# Altium schematic sheet S10_Reset_Logic.SchDoc: Reset Logic
size 381 x 241 mm; SheetNumber: 10; SheetTotal: 12
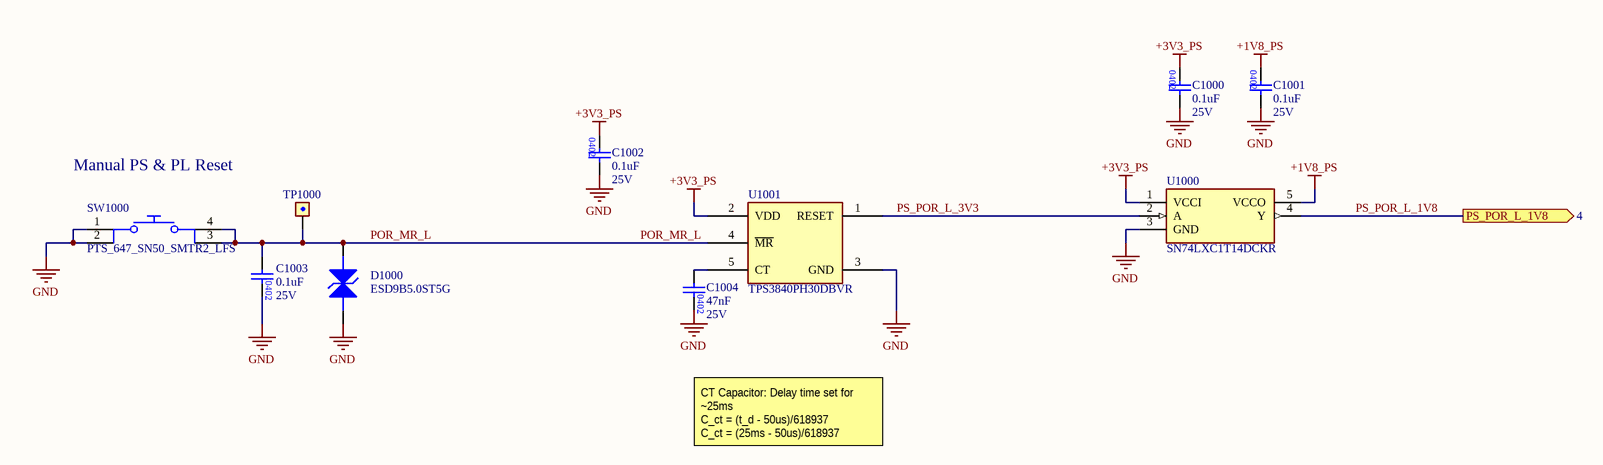
[diagram p0: S10_Reset_Logic.SchDoc]

## Parts
C1000  value 0.1uF  Voltage Rating: 25V  [CAP0402]  (hidden comment: CAP_0402)
C1001  value 0.1uF  Voltage Rating: 25V  [CAP0402]  (hidden comment: CAP_0402)
C1002  value 0.1uF  Voltage Rating: 25V  [CAP0402]  (hidden comment: CAP_0402)
C1003  value 0.1uF  Voltage Rating: 25V  [CAP0402]  (hidden comment: CAP_0402)
C1004  value 47nF  Voltage Rating: 25V  [CAP0402]  (hidden comment: CAP_0402)
D1000  ESD9B5.0ST5G  [ONSEMI_SOD-923]
SW1000  PTS_647_SN50_SMTR2_LFS  [TACTILE_SW_4.5MM]
TP1000  1mm Round Pad Testpoint  [TP_1MM]  (value not drawn)
U1000  SN74LXC1T14DCKR  [TI_SC70_DCK0005A]
U1001  TPS3840PH30DBVR  [TI_SOT23_DBV0005A]

## Ports
PS_POR_L_1V8 (out, see 4)

## Nets
+1V8_PS: C1001.1 U1000.5(VCCO)
+3V3_PS: C1000.1 C1002.1 U1000.1(VCCI) U1001.2(VDD)
GND: C1000.2 C1001.2 C1002.2 C1003.2 C1004.2 D1000.K(Cathode) SW1000.1 SW1000.2 U1000.3(GND) U1001.3(GND)
POR_MR_L: C1003.1 D1000.A(Anode) SW1000.3 SW1000.4 TP1000.1 U1001.4(~{MR})
PS_POR_L_1V8: U1000.4(Y) ; port PS_POR_L_1V8
PS_POR_L_3V3: U1000.2(A) U1001.1(RESET)
NetC1004_1: C1004.1 U1001.5(CT)

## Notes on the sheet
- Manual PS & PL Reset
- CT Capacitor: Delay time set for ~25ms
  C_ct = (t_d - 50us)/618937
  C_ct = (25ms - 50us)/618937
  C_ct = 40.3nF
- Engineer
- Date
- Revision
- Sheet Number

## Library data of the parts
C1000-C1003 = CAP_CL05A104KA5NNNC: CAP CER 0.1UF 25V X5R 0402; Manufacturer: Samsung Electro-Mechanics; Tolerance: 10%; Manufacturer Part Number 1: CL05A104KA5NNNC; Case/Package: 0402; Mounting Type: Surface Mount; Temperature Coefficient: X5R
C1004 = CAP_GRM155R71E473KA88D: CAP CER 0.047UF 25V X7R 0402; Manufacturer: Murata Electronics; Tolerance: 10%; Manufacturer Part Number 1: GRM155R71E473KA88D; Case/Package: 0402; Mounting Type: Surface Mount; Temperature Coefficient: X7R
D1000 = ESD9B5.0ST5G: TVS DIODE 5VWM SOD923; Manufacturer Part Number: ESD9B5.0ST5G
SW1000 = PTS_647_SN50_SMTR2_LFS: SWITCH TACTILE SPST-NO 0.05A 12V
TP1000 = TP_1MM
U1000 = SN74LXC1T14DCKR: IC TRANSLATOR UNIDIR SC70-5
U1001 = TPS3840PH30DBVR: IC SUPERVISOR 1 CHANNEL SOT23-5